# Altium schematic sheet etapa3_anger_X.SchDoc
size A4
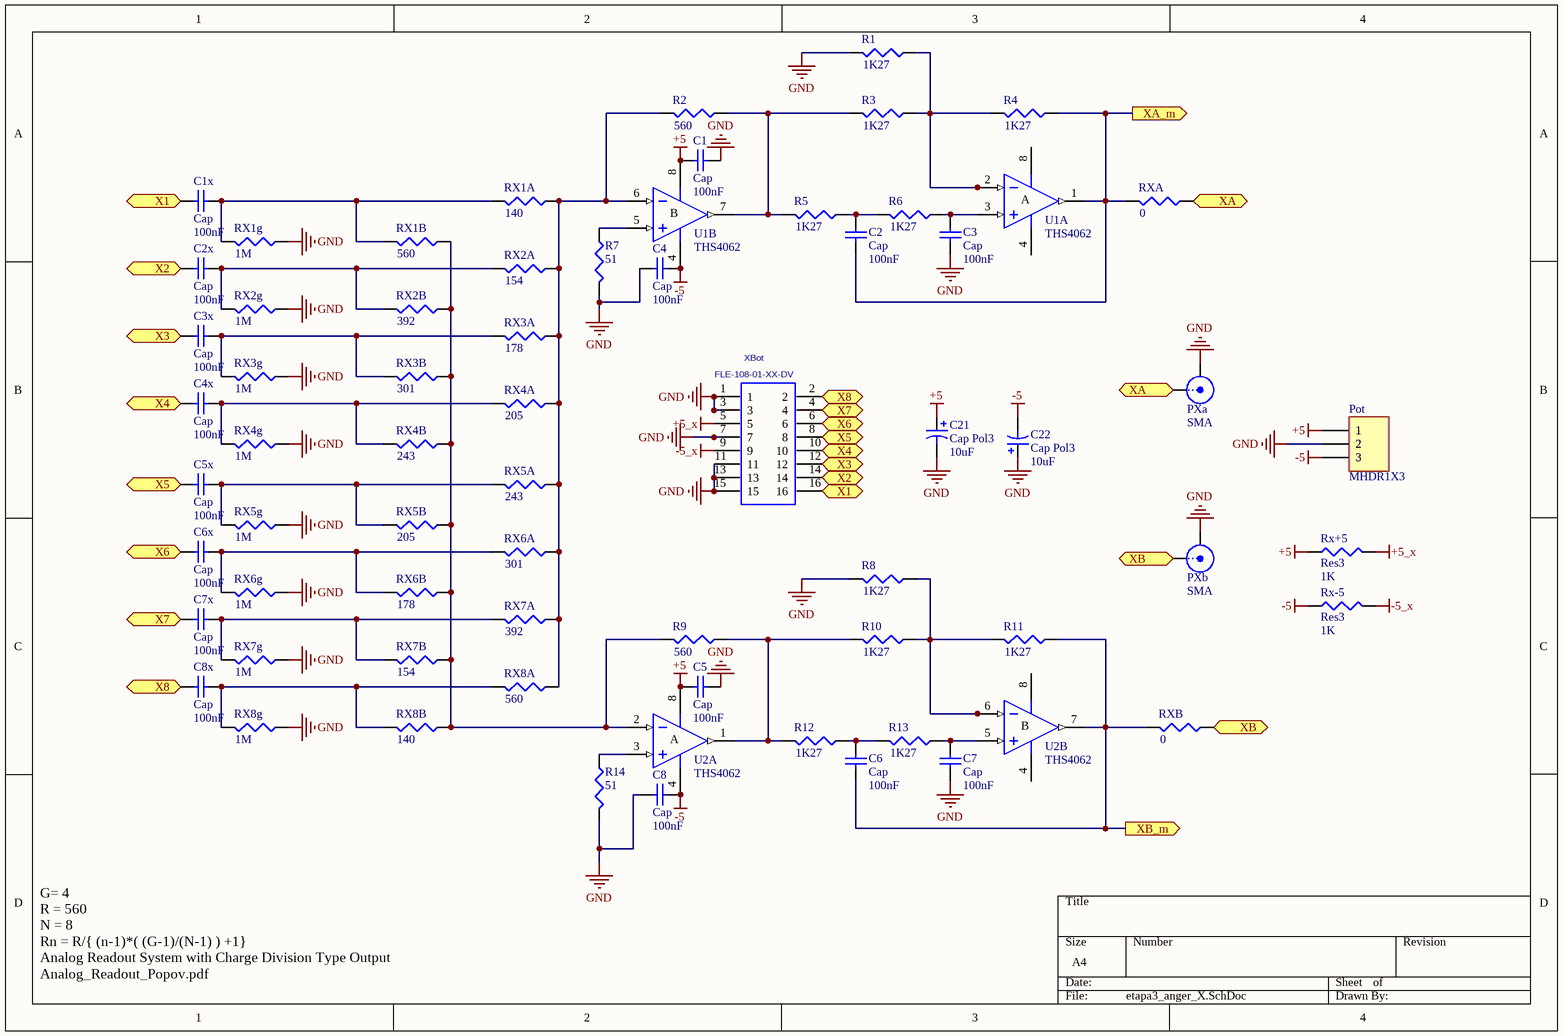
[diagram p0: etapa3_anger_X.SchDoc]

## Parts
C1  Cap  value 100nF  [0402]
C1x  Cap  value 100nF  [0402]
C2  Cap  value 100nF  [0402]
C2x  Cap  value 100nF  [0402]
C3  Cap  value 100nF  [0402]
C3x  Cap  value 100nF  [0402]
C4  Cap  value 100nF  [0402]
C4x  Cap  value 100nF  [0402]
C5  Cap  value 100nF  [0402]
C5x  Cap  value 100nF  [0402]
C6  Cap  value 100nF  [0402]
C6x  Cap  value 100nF  [0402]
C7  Cap  value 100nF  [0402]
C7x  Cap  value 100nF  [0402]
C8  Cap  value 100nF  [0402]
C8x  Cap  value 100nF  [0402]
C21  Cap Pol3  value 10uF  [1608[0603]]
C22  Cap Pol3  value 10uF  [1608[0603]]
Pot  MHDR1X3  [MHDR1X3]
PXa  SMA  [SMB_V-RJ45]
PXb  SMA  [SMB_V-RJ45]
R1  value 1K27  [0402]  (hidden comment: Res3)
R2  value 560  [0402]  (hidden comment: Res3)
R3  value 1K27  [0402]  (hidden comment: Res3)
R4  value 1K27  [0402]  (hidden comment: Res3)
R5  value 1K27  [0402]  (hidden comment: Res3)
R6  value 1K27  [0402]  (hidden comment: Res3)
R7  value 51  [0402]  (hidden comment: Res3)
R8  value 1K27  [0402]  (hidden comment: Res3)
R9  value 560  [0402]  (hidden comment: Res3)
R10  value 1K27  [0402]  (hidden comment: Res3)
R11  value 1K27  [0402]  (hidden comment: Res3)
R12  value 1K27  [0402]  (hidden comment: Res3)
R13  value 1K27  [0402]  (hidden comment: Res3)
R14  value 51  [0402]  (hidden comment: Res3)
RX1A  value 140  [0402]  (hidden comment: Res3)
RX1B  value 560  [0402]  (hidden comment: Res3)
RX1g  value 1M  [0402]  (hidden comment: Res3)
RX2A  value 154  [0402]  (hidden comment: Res3)
RX2B  value 392  [0402]  (hidden comment: Res3)
RX2g  value 1M  [0402]  (hidden comment: Res3)
RX3A  value 178  [0402]  (hidden comment: Res3)
RX3B  value 301  [0402]  (hidden comment: Res3)
RX3g  value 1M  [0402]  (hidden comment: Res3)
RX4A  value 205  [0402]  (hidden comment: Res3)
RX4B  value 243  [0402]  (hidden comment: Res3)
RX4g  value 1M  [0402]  (hidden comment: Res3)
RX5A  value 243  [0402]  (hidden comment: Res3)
RX5B  value 205  [0402]  (hidden comment: Res3)
RX5g  value 1M  [0402]  (hidden comment: Res3)
RX6A  value 301  [0402]  (hidden comment: Res3)
RX6B  value 178  [0402]  (hidden comment: Res3)
RX6g  value 1M  [0402]  (hidden comment: Res3)
RX7A  value 392  [0402]  (hidden comment: Res3)
RX7B  value 154  [0402]  (hidden comment: Res3)
RX7g  value 1M  [0402]  (hidden comment: Res3)
RX8A  value 560  [0402]  (hidden comment: Res3)
RX8B  value 140  [0402]  (hidden comment: Res3)
RX8g  value 1M  [0402]  (hidden comment: Res3)
Rx+5  Res3  value 1K  [J1-0603]
Rx-5  Res3  value 1K  [J1-0603]
RXA  value 0  [0402]  (hidden comment: Res3)
RXB  value 0  [0402]  (hidden comment: Res3)
U1  THS4062  [SO-8_M]  (parts A,B of 2)
U2  THS4062  [SO-8_M]  (parts A,B of 2)
XBot  FLE-108-01-XX-DV  [FLE-108-01-XX-DV]

## Ports
X1 (out), X2 (out), X3 (out), X4 (out), X5 (out), X6 (out), X7 (out), X8 (out), XA (out), XA_m (out), XB (out), XB_m (out)

## Nets
+5: C1.1 C5.1 C21.1 Pot.1 Rx+5.1 U1.8(V+) U2.8(V+)
+5_x: Rx+5.2 XBot.5
-5: C4.2 C8.2 C22.2 Pot.3 Rx-5.1 U1.4(V-) U2.4(V-)
-5_x: Rx-5.2 XBot.9
GND: C1.2 C3.2 C4.1 C5.2 C7.2 C8.1 C21.2 C22.1 Pot.2 PXa.2(Y) PXb.2(Y) R1.2 R7.2 R8.2 R14.2 RX1g.1 RX2g.1 RX3g.1 RX4g.1 RX5g.1 RX6g.1 RX7g.1 RX8g.1 XBot.1 XBot.3 XBot.7 XBot.11 XBot.13 XBot.15
X1: C1x.1 XBot.16 ; port X1
X2: C2x.1 XBot.14 ; port X2
X3: C3x.1 XBot.12 ; port X3
X4: C4x.1 XBot.10 ; port X4
X5: C5x.1 XBot.8 ; port X5
X6: C6x.1 XBot.6 ; port X6
X7: C7x.1 XBot.4 ; port X7
X8: C8x.1 XBot.2 ; port X8
XA: PXa.1(X) RXA.1 ; port XA
XA_m: C2.2 R4.1 RXA.2 U1.1(OUT) ; port XA_m
XB: PXb.1(X) RXB.1 ; port XB
XB_m: C6.2 R11.1 RXB.2 U2.7(OUT) ; port XB_m
NetC1x_2: C1x.2 RX1A.2 RX1B.2 RX1g.2
NetC2_1: C2.1 R5.1 R6.2
NetC2x_2: C2x.2 RX2A.2 RX2B.2 RX2g.2
NetC3_1: C3.1 R6.1 U1.3(IN+)
NetC3x_2: C3x.2 RX3A.2 RX3B.2 RX3g.2
NetC4x_2: C4x.2 RX4A.2 RX4B.2 RX4g.2
NetC5x_2: C5x.2 RX5A.2 RX5B.2 RX5g.2
NetC6_1: C6.1 R12.1 R13.2
NetC6x_2: C6x.2 RX6A.2 RX6B.2 RX6g.2
NetC7_1: C7.1 R13.1 U2.5(IN+)
NetC7x_2: C7x.2 RX7A.2 RX7B.2 RX7g.2
NetC8x_2: C8x.2 RX8A.2 RX8B.2 RX8g.2
NetR1_1: R1.1 R3.1 R4.2 U1.2(IN-)
NetR2_1: R2.1 R3.2 R5.2 U1.7(OUT)
NetR2_2: R2.2 RX1A.1 RX2A.1 RX3A.1 RX4A.1 RX5A.1 RX6A.1 RX7A.1 RX8A.1 U1.6(IN-)
NetR7_1: R7.1 U1.5(IN+)
NetR8_1: R8.1 R10.1 R11.2 U2.6(IN-)
NetR9_1: R9.1 R10.2 R12.2 U2.1(OUT)
NetR9_2: R9.2 RX1B.1 RX2B.1 RX3B.1 RX4B.1 RX5B.1 RX6B.1 RX7B.1 RX8B.1 U2.2(IN-)
NetR14_1: R14.1 U2.3(IN+)

## Notes on the sheet
- G= 4
  R = 560
  N = 8
  Rn = R/{ (n-1)*( (G-1)/(N-1) ) +1}
  Analog Readout System with Charge Division Type Output
  Analog_Readout_Popov.pdf
- (in symbol AD8002AR, part A) A
- (in symbol AD8002AR, part B) B

## Library data of the parts
C1 C1x C2 C2x C3 C3x C4 C4x C5 C5x C6 C6x C7 C7x C8 C8x = Cap: Capacitor; Published: 8-Jun-2000; LatestRevisionDate: 17-Jul-2002; LatestRevisionNote: Re-released for DXP Platform.; PackageReference: RAD-0.3; Publisher: Altium Limited; PackageDescription: Radial Cap, Thru-Hole; 2 Leads; 0.3 in Pin Spacing
C21 C22 = Cap Pol3: Polarized Capacitor (Surface Mount); Published: 8-Jun-2000; LatestRevisionDate: 29-May-2009; LatestRevisionNote: IPC-7351 Footprint Added.; PackageReference: C0805; Publisher: Altium Limited; PackageDescription: Chip Capacitor
Pot = MHDR1X3: Header, 3-Pin; LatestRevisionDate: 17-Jul-2002; LatestRevisionNote: Re-released for DXP Platform.; Publisher: Altium Limited
PXa PXb = SMB: SMB Straight Connector; LatestRevisionDate: 17-Jul-2002; LatestRevisionNote: Re-released for DXP Platform.; Publisher: Altium Limited
R1-R14 RX1A RX1B RX1g RX2A RX2B RX2g RX3A RX3B RX3g RX4A RX4B RX4g RX5A RX5B RX5g RX6A RX6B RX6g RX7A RX7B RX7g RX8A RX8B RX8g Rx+5 Rx-5 RXA RXB = Res3: Resistor; Published: 8-Jun-2000; LatestRevisionDate: 29-May-2009; LatestRevisionNote: IPC-7351 Footprint Added.; PackageReference: J1-0603; Publisher: Altium Limited; PackageDescription: Chip Resistor
U1 U2 = AD8002AR: Dual 600MHz, 50mW Current Feedback Amplifier; Published: 8-Jun-2000; LatestRevisionDate: 13-Apr-2006; LatestRevisionNote: IPC-7351 Footprint Added.; DatasheetVersion: REV. C 1999; PackageVersion: revA; PackageReference: SO-8; Publisher: Altium Limited; PackageDescription: 8-Pin Small Outline Integrated Circuit 1.27 mm Pitch; Code_JEDEC: MS-012-AA; Code_IPC: SOIC127P600-8; ComponentLink1Description: Manufacturer Link; ComponentLink1URL: http://www.analog.com/en/prod/0,,759_786_AD8002%2C00.html; ComponentLink2Description: Datasheet; ComponentLink2URL: http://www.analog.com/UploadedFiles/Data_Sheets/147523773AD8002_d.pdf
XBot = FLE-108-01-XX-DV: DUAL ROW 0.050'' STRIP ASSEMBLY.; MANUFACTURER: SAMTEC; CREATED: December 2, 2014 - Wendy Xin; PCB DECAL: FLE-108-01-XX-DV